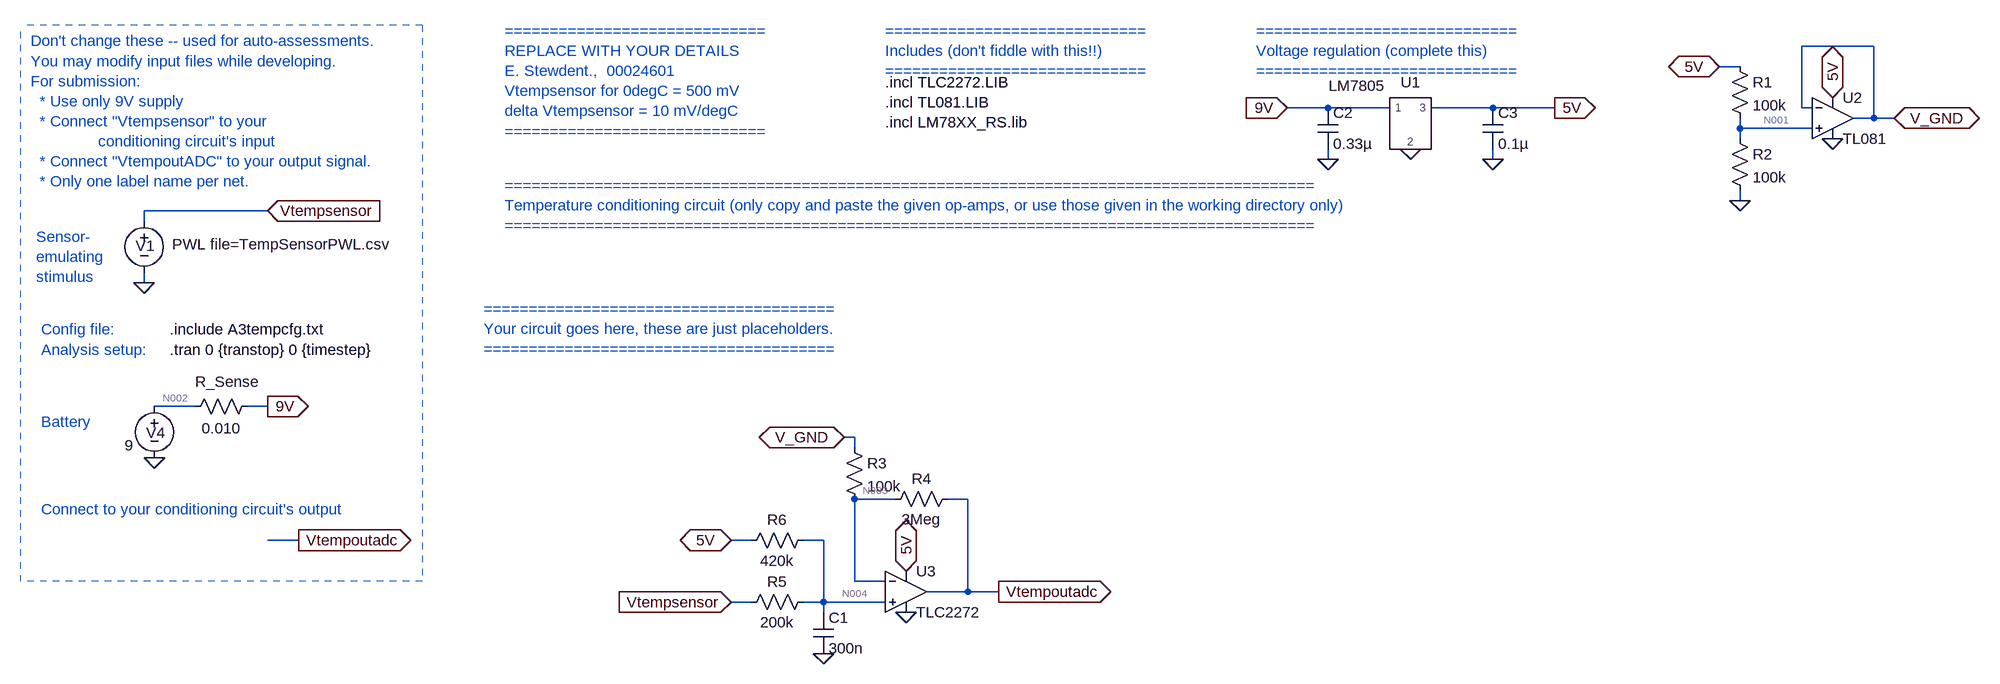
[diagram p0: schematic E344_A3_temp.asc]
E344_A3_temp.asc, the LTspice schematic file:
Version 4
SHEET 1 1824 680
WIRE 576 -1376 464 -1376
WIRE 368 -1344 336 -1344
WIRE -272 -1280 -336 -1280
WIRE -176 -1280 -272 -1280
WIRE -16 -1280 -112 -1280
WIRE 80 -1280 -16 -1280
WIRE 464 -1280 464 -1376
WIRE 480 -1280 464 -1280
WIRE 576 -1264 576 -1376
WIRE 576 -1264 544 -1264
WIRE 608 -1264 576 -1264
WIRE 368 -1248 368 -1264
WIRE 480 -1248 368 -1248
WIRE 368 -1232 368 -1248
WIRE -272 -1200 -272 -1216
WIRE -16 -1200 -16 -1216
WIRE 368 -1136 368 -1152
WIRE -1920 -1120 -2112 -1120
WIRE -2112 -1104 -2112 -1120
WIRE -2112 -1008 -2112 -1024
WIRE -2032 -816 -2096 -816
WIRE -1920 -816 -1952 -816
WIRE -1008 -768 -1024 -768
WIRE -1008 -752 -1008 -768
WIRE -944 -672 -1008 -672
WIRE -832 -672 -864 -672
WIRE -1872 -608 -1920 -608
WIRE -1168 -608 -1200 -608
WIRE -1056 -608 -1088 -608
WIRE -1008 -544 -1008 -672
WIRE -960 -544 -1008 -544
WIRE -832 -528 -832 -672
WIRE -832 -528 -896 -528
WIRE -784 -528 -832 -528
WIRE -1168 -512 -1200 -512
WIRE -1056 -512 -1056 -608
WIRE -1056 -512 -1088 -512
WIRE -960 -512 -1056 -512
WIRE -1056 -496 -1056 -512
FLAG -2112 -1008 0
FLAG -1920 -1120 Vtempsensor
IOPIN -1920 -1120 In
FLAG -1920 -816 9V
IOPIN -1920 -816 Out
FLAG -2096 -736 0
FLAG -336 -1280 9V
IOPIN -336 -1280 In
FLAG -1200 -512 Vtempsensor
IOPIN -1200 -512 In
FLAG -144 -1216 0
FLAG 80 -1280 5V
IOPIN 80 -1280 Out
FLAG -784 -528 Vtempoutadc
IOPIN -784 -528 Out
FLAG -1872 -608 Vtempoutadc
IOPIN -1872 -608 Out
FLAG 608 -1264 V_GND
IOPIN 608 -1264 BiDir
FLAG 336 -1344 5V
IOPIN 336 -1344 BiDir
FLAG 368 -1136 0
FLAG 512 -1296 5V
IOPIN 512 -1296 BiDir
FLAG 512 -1232 0
FLAG -1024 -768 V_GND
IOPIN -1024 -768 BiDir
FLAG -928 -496 0
FLAG -928 -560 5V
IOPIN -928 -560 BiDir
FLAG -1056 -432 0
FLAG -1200 -608 5V
IOPIN -1200 -608 BiDir
FLAG -272 -1200 0
FLAG -16 -1200 0
SYMBOL voltage -2112 -1120 R0
WINDOW 123 0 0 Left 0
WINDOW 39 0 0 Left 0
WINDOW 3 44 52 Left 2
WINDOW 0 -13 54 Left 2
SYMATTR Value PWL file=TempSensorPWL.csv
SYMATTR InstName V1
SYMBOL voltage -2096 -832 R0
WINDOW 123 24 44 Left 2
WINDOW 39 0 0 Left 0
WINDOW 3 -46 76 Left 2
WINDOW 0 -13 57 Left 2
SYMATTR Value 9
SYMATTR InstName V4
SYMBOL res -1936 -832 R90
WINDOW 0 -7 47 VBottom 2
WINDOW 3 34 56 VTop 2
SYMATTR InstName R_Sense
SYMATTR Value 0.010
SYMBOL LM7805 -144 -1264 R0
WINDOW 3 -83 -66 Top 2
SYMATTR InstName U1
SYMBOL res 352 -1360 R0
SYMATTR InstName R1
SYMATTR Value 100k
SYMBOL res 352 -1248 R0
SYMATTR InstName R2
SYMATTR Value 100k
SYMBOL Opamps\\opamp2 512 -1328 R0
SYMATTR InstName U2
SYMATTR Value TL081
SYMBOL Opamps\\opamp2 -928 -592 R0
SYMATTR InstName U3
SYMATTR Value TLC2272
SYMBOL res -1024 -768 R0
SYMATTR InstName R3
SYMATTR Value 100k
SYMBOL res -848 -688 R90
WINDOW 0 0 56 VBottom 2
WINDOW 3 32 56 VTop 2
SYMATTR InstName R4
SYMATTR Value 3Meg
SYMBOL res -1072 -528 R90
WINDOW 0 0 56 VBottom 2
WINDOW 3 32 56 VTop 2
SYMATTR InstName R5
SYMATTR Value 200k
SYMBOL cap -1072 -496 R0
SYMATTR InstName C1
SYMATTR Value 300n
SYMBOL res -1072 -624 R90
WINDOW 0 0 56 VBottom 2
WINDOW 3 32 56 VTop 2
SYMATTR InstName R6
SYMATTR Value 420k
SYMBOL cap -288 -1280 R0
SYMATTR InstName C2
SYMATTR Value 0.33µ
SYMBOL cap -32 -1280 R0
SYMATTR InstName C3
SYMATTR Value 0.1µ
TEXT -2072 -904 Left 2 !.tran 0 {transtop} 0 {timestep}
TEXT -2072 -936 Left 2 !.include A3tempcfg.txt
TEXT -2288 -1384 Left 2 ;Don't change these -- used for auto-assessments.\nYou may modify input files while developing.\nFor submission: \n  * Use only 9V supply \n  * Connect "Vtempsensor" to your \n               conditioning circuit's input\n  * Connect "VtempoutADC" to your output signal.\n  * Only one label name per net.
TEXT -2272 -936 Left 2 ;Config file:
TEXT -2272 -904 Left 2 ;Analysis setup:
TEXT -2272 -792 Left 2 ;Battery
TEXT -2280 -1080 Left 2 ;Sensor-\nemulating \nstimulus
TEXT -1552 -1400 Left 2 ;=============================\nREPLACE WITH YOUR DETAILS\nE. Stewdent.,  00024601\nVtempsensor for 0degC = 500 mV\ndelta Vtempsensor = 10 mV/degC\n=============================
TEXT -1552 -1160 Left 2 ;==========================================================================================\nTemperature conditioning circuit (only copy and paste the given op-amps, or use those given in the working directory only)\n==========================================================================================
TEXT -384 -1400 Left 2 ;=============================\nVoltage regulation (complete this)\n=============================
TEXT -960 -1320 Left 2 !.incl TLC2272.LIB\n.incl TL081.LIB\n.incl LM78XX_RS.lib
TEXT -2272 -656 Left 2 ;Connect to your conditioning circuit's output
TEXT -960 -1400 Left 2 ;=============================\nIncludes (don't fiddle with this!!)\n=============================
TEXT -1584 -968 Left 2 ;=======================================\nYour circuit goes here, these are just placeholders.\n=======================================
LINE Normal -2304 -544 -2304 -1408 1
LINE Normal -1680 -1408 -1680 -544 1
LINE Normal -1680 -544 -2304 -544 1
LINE Normal -1680 -1408 -2304 -1408 1

The netlist it stands for:
* E344_A3_temp.asc
V1 Vtempsensor 0 PWL file=TempSensorPWL.csv
V4 N002 0 9
R_Sense 9V N002 0.010
XU1 9V 0 5V LM7805  ; pins 1 2 3
R1 5V N001 100k
R2 N001 0 100k
XU2 N001 V_GND 5V 0 V_GND TL081  ; pins In+ In- V+ V- OUT
XU3 N004 N003 5V 0 Vtempoutadc TLC2272  ; pins In+ In- V+ V- OUT
R3 V_GND N003 100k
R4 Vtempoutadc N003 3Meg
R5 N004 Vtempsensor 200k
C1 N004 0 300n
R6 N004 5V 420k
C2 9V 0 0.33µ
C3 5V 0 0.1µ
.tran 0 {transtop} 0 {timestep}
.include A3tempcfg.txt
* Don't change these -- used for auto-assessments.
* You may modify input files while developing.
* For submission:
*   * Use only 9V supply
*   * Connect "Vtempsensor" to your
*                conditioning circuit's input
*   * Connect "VtempoutADC" to your output signal.
*   * Only one label name per net.
* Config file:
* Analysis setup:
* Battery
* Sensor-
* emulating
* stimulus
* =============================
* REPLACE WITH YOUR DETAILS
* E. Stewdent.,  00024601
* Vtempsensor for 0degC = 500 mV
* delta Vtempsensor = 10 mV/degC
* =============================
* ==========================================================================================
* Temperature conditioning circuit (only copy and paste the given op-amps, or use those given in the working directory only)
* ==========================================================================================
* =============================
* Voltage regulation (complete this)
* =============================
.incl TLC2272.LIB
.incl TL081.LIB
.incl LM78XX_RS.lib
* Connect to your conditioning circuit's output
* =============================
* Includes (don't fiddle with this!!)
* =============================
* =======================================
* Your circuit goes here, these are just placeholders.
* =======================================
.lib LM78XX_RS.lib
.backanno
.end

* Results of the author's LTspice run, read from the files saved beside the schematic
* Operating Point, zero values left out:
*   V(vtempsensor) = 1.32 V
*   V(n002) = 9 V
*   V(9v) = 9 V
*   V(5v) = 5.003 V
*   V(n001) = 2.501 V
*   V(v_gnd) = 2.501 V
*   V(vtempoutadc) = 2.719 V
*   V(n003) = 2.508 V
*   V(n004) = 2.508 V
*   I(R6) = -5.94 µA
*   I(R5) = 5.94 µA
*   I(R4) = 70.12 nA
*   I(R3) = -70.11 nA
*   I(R2) = 25.01 µA
*   I(R1) = 25.01 µA
*   I(R_sense) = -9.981 mA
*   I(V4) = -9.981 mA
*   I(V1) = 5.94 µA
*   Ix(u1:1) = 9.981 mA
*   Ix(u1:2) = -5.02 mA
*   Ix(u1:3) = -4.961 mA
*   Ix(u2:1) = 32.55 pA
*   Ix(u2:2) = 32.55 pA
*   Ix(u2:3) = 2.53 mA
*   Ix(u2:4) = -2.53 mA
*   Ix(u2:5) = 70.08 nA
*   Ix(u3:IN+) = 3.73 pA
*   Ix(u3:IN-) = 3.02 pA
*   Ix(u3:VCC) = 2.4 mA
*   Ix(u3:VEE) = -2.4 mA
*   Ix(u3:OUT) = -70.12 nA